# EAGLE schematic Mainboard_v3_modular (EAGLE 7.7.0)
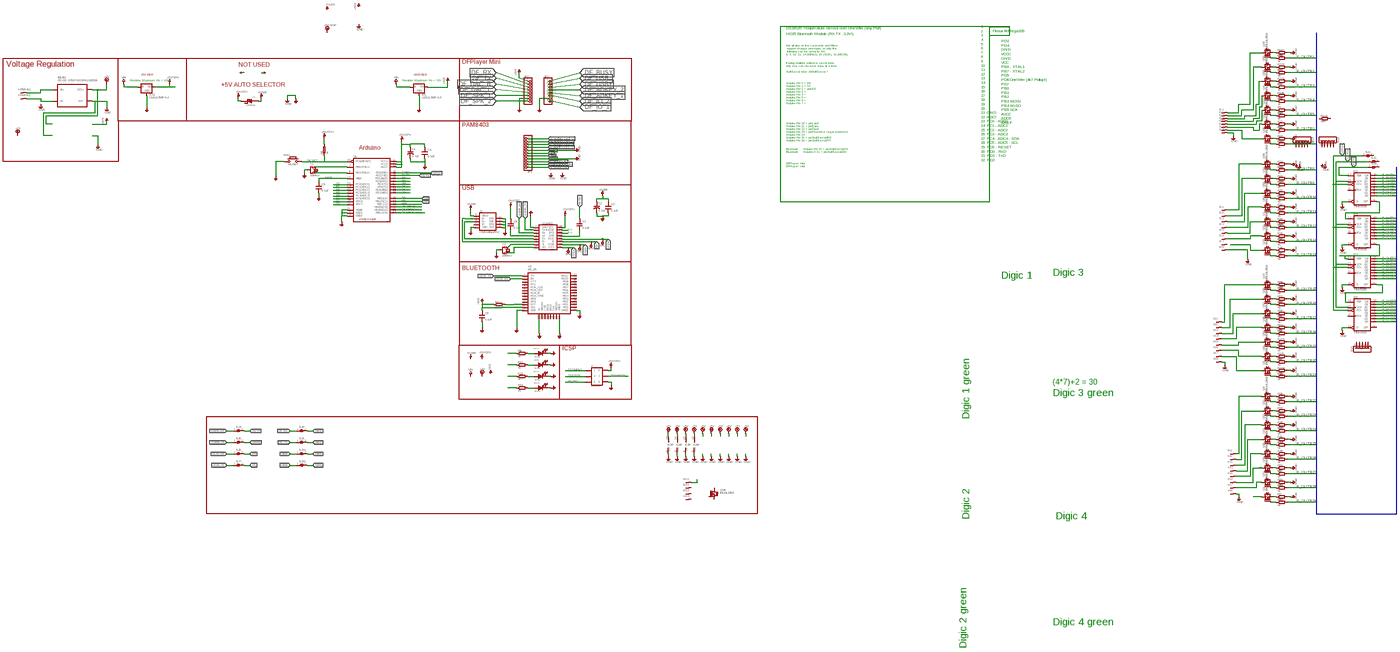
[diagram p0: schematic, sheet 1, overview]
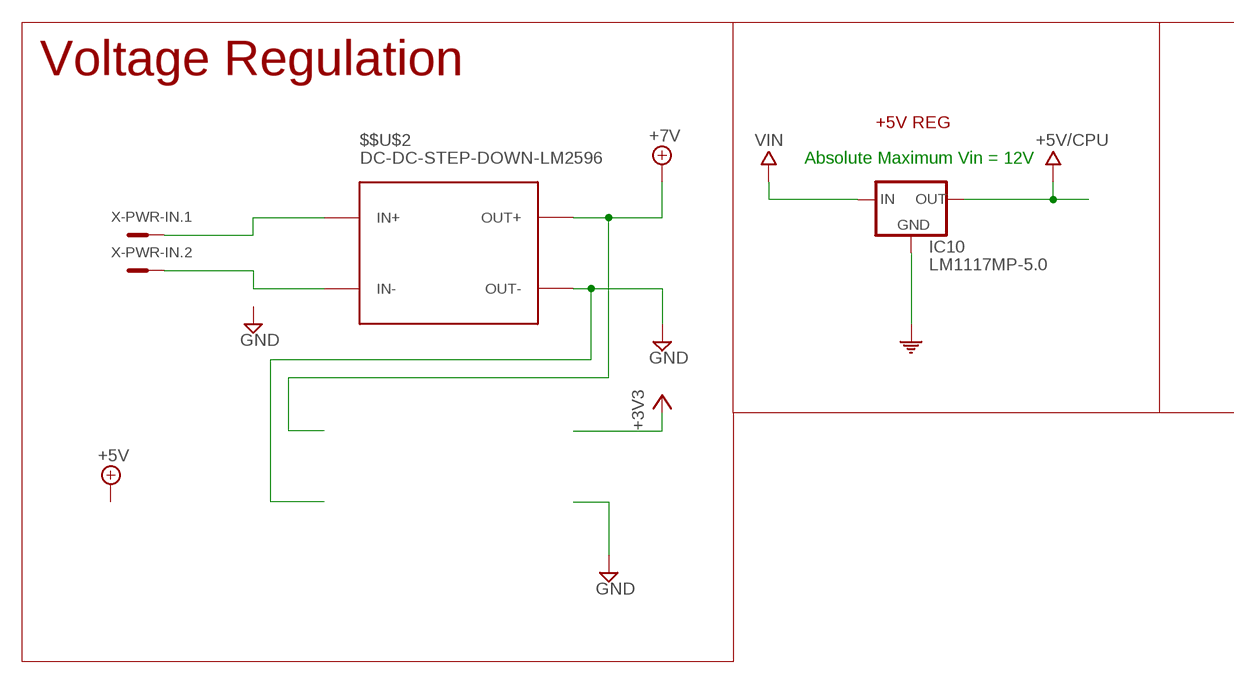
[diagram p1: schematic, sheet 1, part 1 of 5]
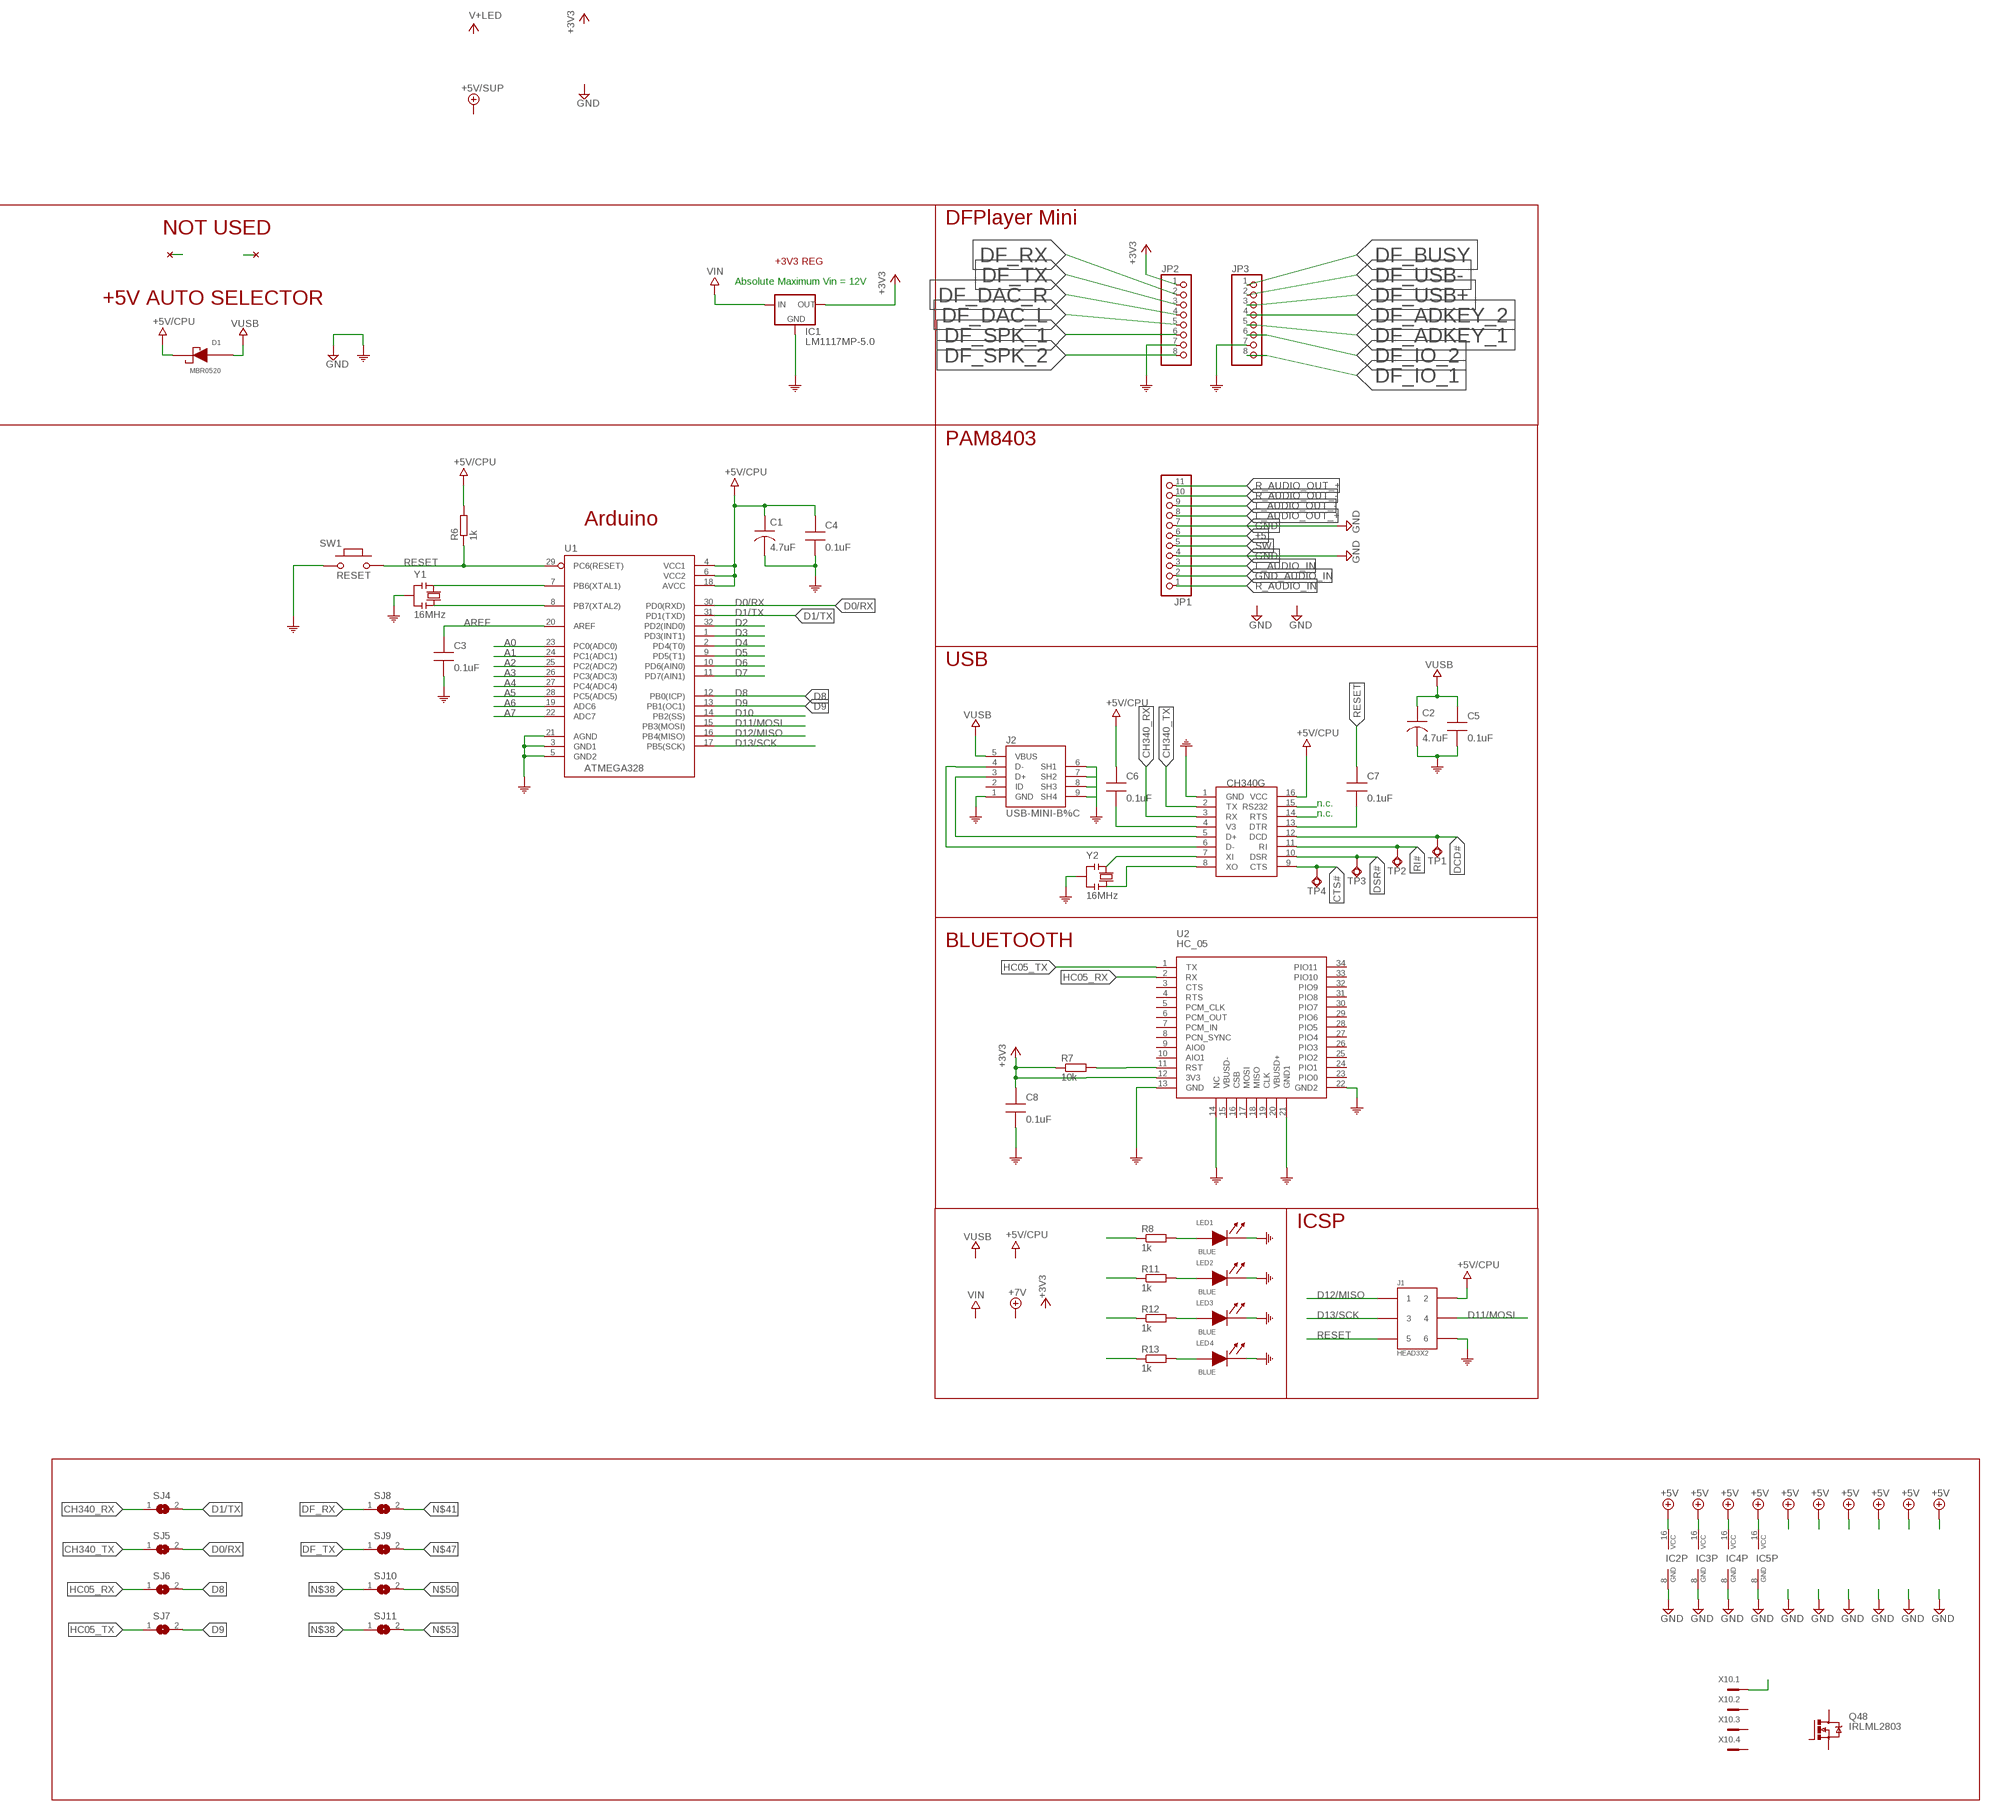
[diagram p2: schematic, sheet 1, part 2 of 5]
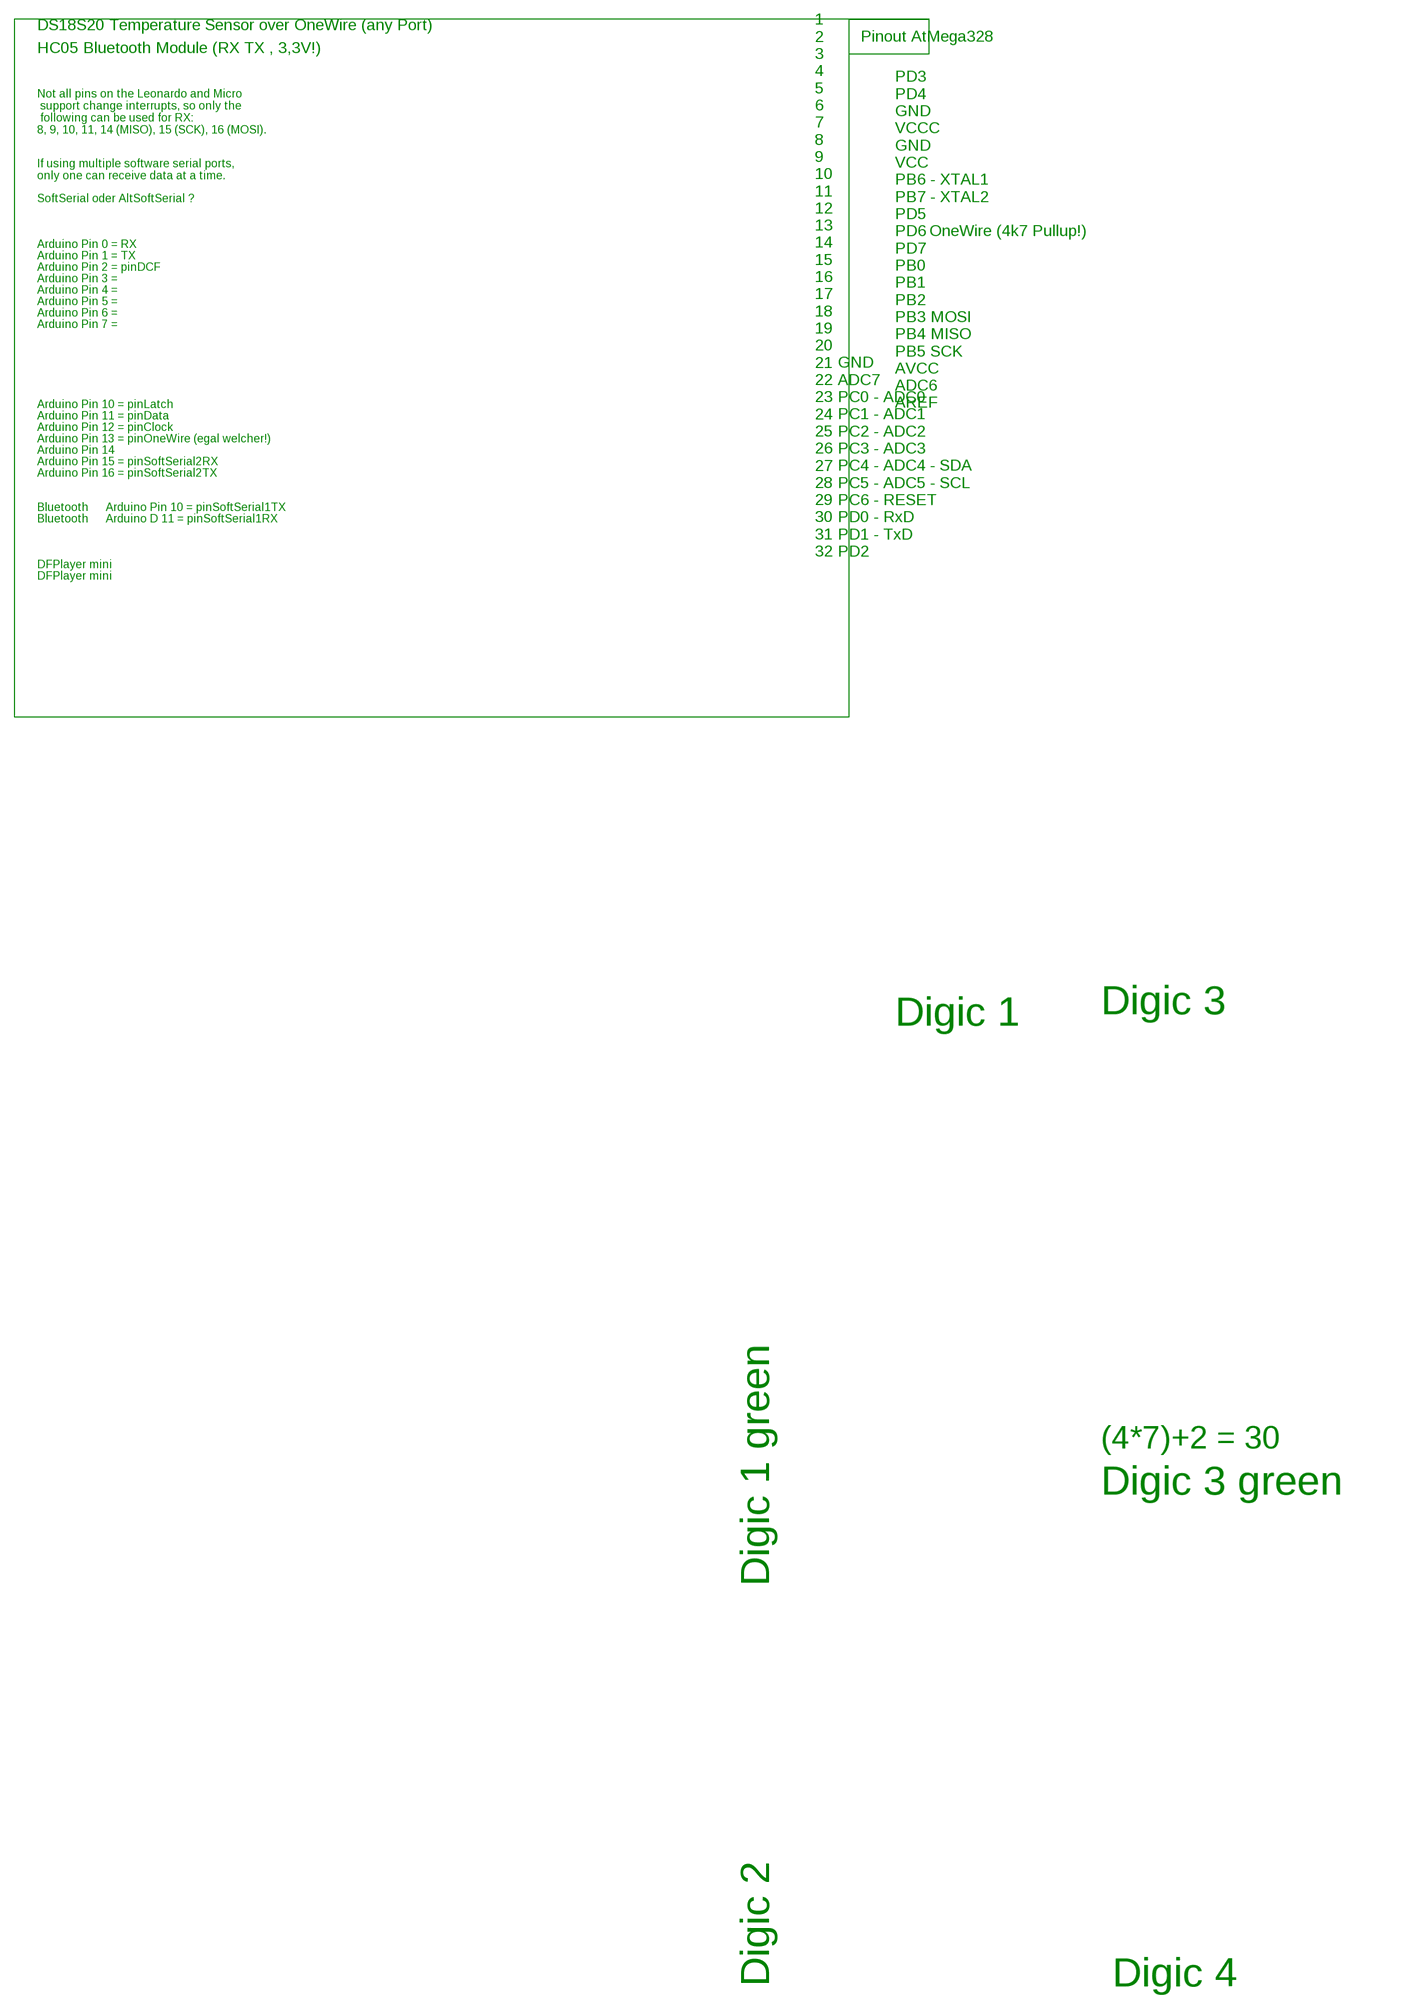
[diagram p3: schematic, sheet 1, part 3 of 5]
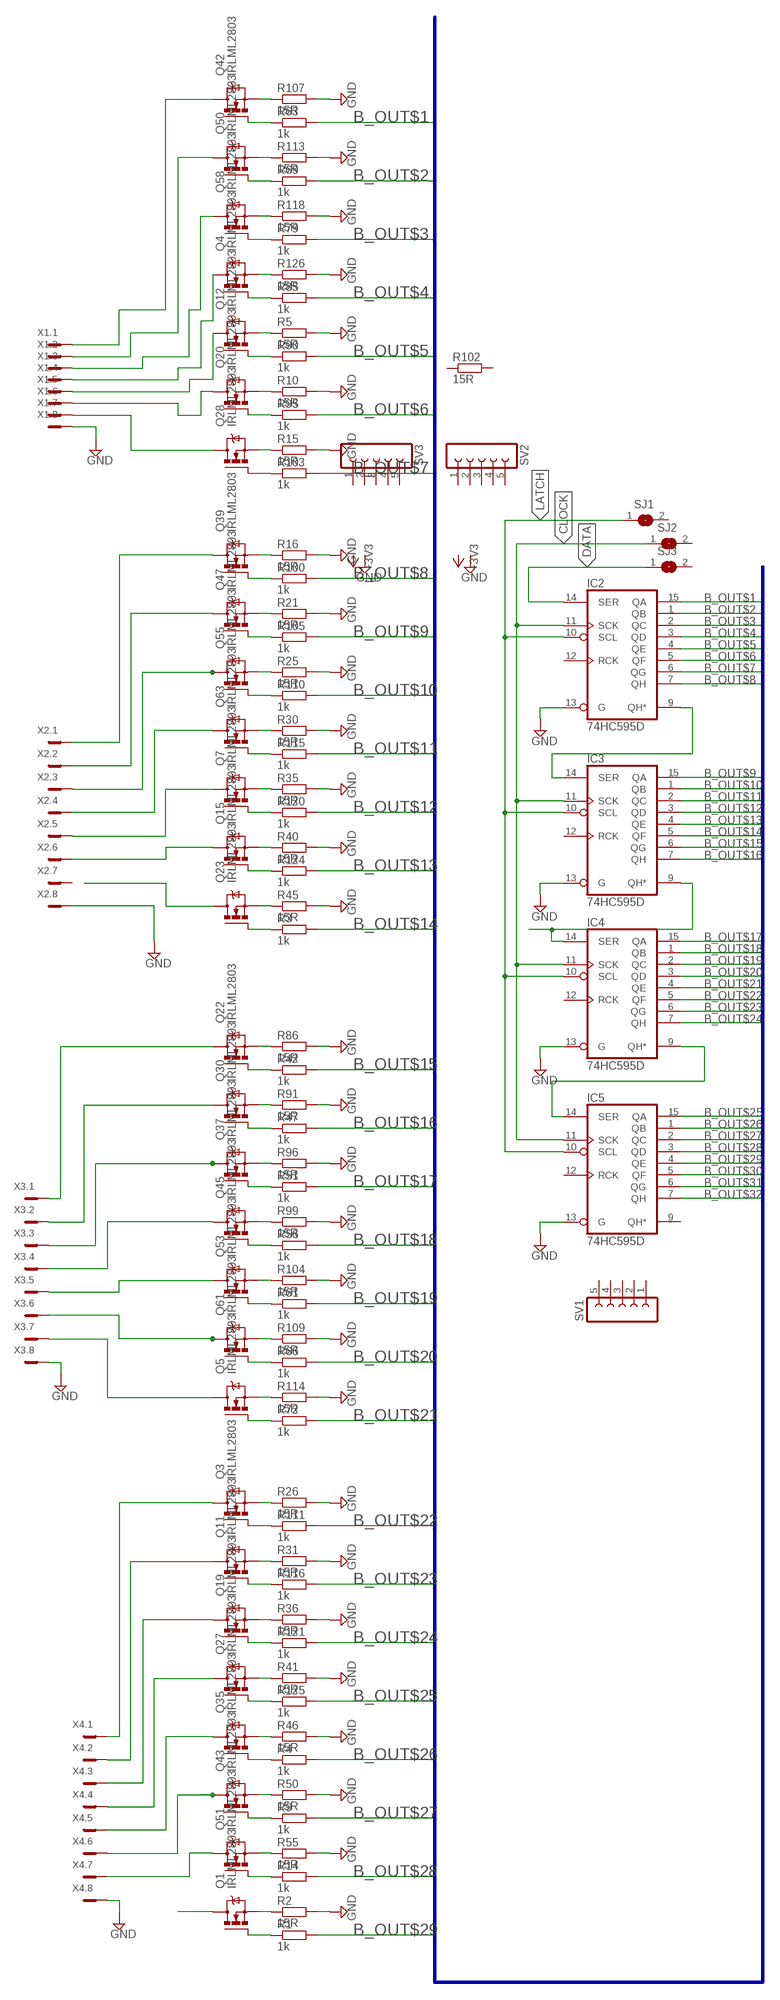
[diagram p4: schematic, sheet 1, part 4 of 5]
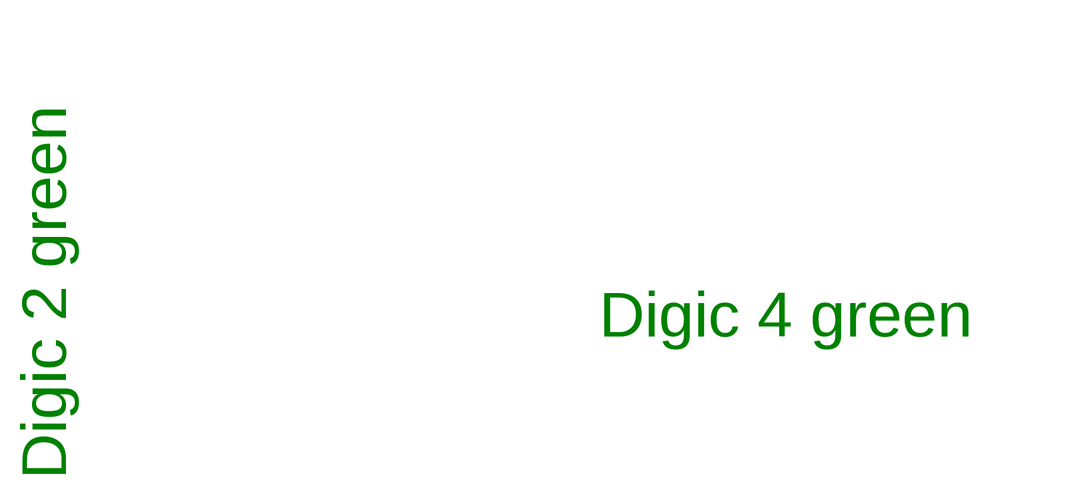
[diagram p5: schematic, sheet 1, part 5 of 5]

## Parts
$$U$2  DC-DC-STEP-DOWN-LM2596  [DC-DC-STEP-DOWN-LM2596]
C1  4.7uF  CAP-TANA-P  [TAN-A]
C2  4.7uF  CAP-TANA-P  [TAN-A]
C3  0.1uF  CAP0805-NP  [CAP0805-NP]
C4  0.1uF  CAP0805-NP  [CAP0805-NP]
C5  0.1uF  CAP0805-NP  [CAP0805-NP]
C6  0.1uF  CAP0805-NP  [CAP0805-NP]
C7  0.1uF  CAP0805-NP  [CAP0805-NP]
C8  0.1uF  CAP0805-NP  [CAP0805-NP]
D1  MBR0520  [SOD-123]
IC1  LM1117MP-5.0  [SOT223]
IC2  74HC595D  [SO16]
IC3  74HC595D  [SO16]
IC4  74HC595D  [SO16]
IC5  74HC595D  [SO16]
IC10  LM1117MP-5.0  [SOT223]
J1  HEAD3X2  [HEAD3X2]
J2  USB-MINI-B%C  [USB-MINI-B_2]
JP1  PINHD-1X11_2.00  [1X11M]
JP2  PINHD-1X8  [1X08]
JP3  PINHD-1X8  [1X08]
LED1  BLUE  LED0805  [LED0805]
LED2  BLUE  LED0805  [LED0805]
LED3  BLUE  LED0805  [LED0805]
LED4  BLUE  LED0805  [LED0805]
Q1  IRLML2803  [MICRO3]
Q3  IRLML2803  [MICRO3]
Q4  IRLML2803  [MICRO3]
Q5  IRLML2803  [MICRO3]
Q7  IRLML2803  [MICRO3]
Q11  IRLML2803  [MICRO3]
Q12  IRLML2803  [MICRO3]
Q15  IRLML2803  [MICRO3]
Q19  IRLML2803  [MICRO3]
Q20  IRLML2803  [MICRO3]
Q22  IRLML2803  [MICRO3]
Q23  IRLML2803  [MICRO3]
Q27  IRLML2803  [MICRO3]
Q28  IRLML2803  [MICRO3]
Q30  IRLML2803  [MICRO3]
Q35  IRLML2803  [MICRO3]
Q37  IRLML2803  [MICRO3]
Q39  IRLML2803  [MICRO3]
Q42  IRLML2803  [MICRO3]
Q43  IRLML2803  [MICRO3]
Q45  IRLML2803  [MICRO3]
Q47  IRLML2803  [MICRO3]
Q48  IRLML2803  [MICRO3]
Q50  IRLML2803  [MICRO3]
Q51  IRLML2803  [MICRO3]
Q53  IRLML2803  [MICRO3]
Q55  IRLML2803  [MICRO3]
Q58  IRLML2803  [MICRO3]
Q61  IRLML2803  [MICRO3]
Q63  IRLML2803  [MICRO3]
R1  1k  R-EU_M0805  [M0805]
R2  15R  R-EU_M1206  [M1206]
R3  1k  R-EU_M0805  [M0805]
R4  1k  R-EU_M0805  [M0805]
R5  15R  R-EU_M1206  [M1206]
R6  1k  R-EU_M1206  [M1206]
R7  10k  R-EU_M1206  [M1206]
R8  1k  R-EU_M1206  [M1206]
R9  1k  R-EU_M0805  [M0805]
R10  15R  R-EU_M1206  [M1206]
R11  1k  R-EU_M1206  [M1206]
R12  1k  R-EU_M1206  [M1206]
R13  1k  R-EU_M1206  [M1206]
R14  1k  R-EU_M0805  [M0805]
R15  15R  R-EU_M1206  [M1206]
R16  15R  R-EU_M1206  [M1206]
R21  15R  R-EU_M1206  [M1206]
R25  15R  R-EU_M1206  [M1206]
R26  15R  R-EU_M1206  [M1206]
R30  15R  R-EU_M1206  [M1206]
R31  15R  R-EU_M1206  [M1206]
R35  15R  R-EU_M1206  [M1206]
R36  15R  R-EU_M1206  [M1206]
R40  15R  R-EU_M1206  [M1206]
R41  15R  R-EU_M1206  [M1206]
R42  1k  R-EU_M0805  [M0805]
R45  15R  R-EU_M1206  [M1206]
R46  15R  R-EU_M1206  [M1206]
R47  1k  R-EU_M0805  [M0805]
R50  15R  R-EU_M1206  [M1206]
R51  1k  R-EU_M0805  [M0805]
R55  15R  R-EU_M1206  [M1206]
R56  1k  R-EU_M0805  [M0805]
R61  1k  R-EU_M0805  [M0805]
R63  1k  R-EU_M0805  [M0805]
R66  1k  R-EU_M0805  [M0805]
R69  1k  R-EU_M0805  [M0805]
R72  1k  R-EU_M0805  [M0805]
R79  1k  R-EU_M0805  [M0805]
R85  1k  R-EU_M0805  [M0805]
R86  15R  R-EU_M1206  [M1206]
R90  1k  R-EU_M0805  [M0805]
R91  15R  R-EU_M1206  [M1206]
R95  1k  R-EU_M0805  [M0805]
R96  15R  R-EU_M1206  [M1206]
R99  15R  R-EU_M1206  [M1206]
R100  1k  R-EU_M0805  [M0805]
R102  15R  R-EU_M1206  [M1206]
R103  1k  R-EU_M0805  [M0805]
R104  15R  R-EU_M1206  [M1206]
R105  1k  R-EU_M0805  [M0805]
R107  15R  R-EU_M1206  [M1206]
R109  15R  R-EU_M1206  [M1206]
R110  1k  R-EU_M0805  [M0805]
R111  1k  R-EU_M0805  [M0805]
R113  15R  R-EU_M1206  [M1206]
R114  15R  R-EU_M1206  [M1206]
R115  1k  R-EU_M0805  [M0805]
R116  1k  R-EU_M0805  [M0805]
R118  15R  R-EU_M1206  [M1206]
R120  1k  R-EU_M0805  [M0805]
R121  1k  R-EU_M0805  [M0805]
R124  1k  R-EU_M0805  [M0805]
R125  1k  R-EU_M0805  [M0805]
R126  15R  R-EU_M1206  [M1206]
SJ1  SJ  [SJ]
SJ2  SJ  [SJ]
SJ3  SJ  [SJ]
SJ4  SJ  [SJ]
SJ5  SJ  [SJ]
SJ6  SJ  [SJ]
SJ7  SJ  [SJ]
SJ8  SJ  [SJ]
SJ9  SJ  [SJ]
SJ10  SJ  [SJ]
SJ11  SJ  [SJ]
SV1  FE05-1  [FE05-1]
SV2  FE05-1  [FE05-1]
SV3  FE05-1  [FE05-1]
SW1  RESET  PB157  [157SW]
TP1  TPSQTP14R  [TP14R]
TP2  TPSQTP14R  [TP14R]
TP3  TPSQTP14R  [TP14R]
TP4  TPSQTP14R  [TP14R]
U1  ATMEGA328  ATMEGA168-20AU  [QFP032]
U2  HC_05  [BLUETOOTH_SMD]
U$9  CH340G  [SOIC16]
X1  MCV8-LOCK  [MCV8-LOCK]
X2  MCV8-LOCK  [MCV8-LOCK]
X3  MCV8-LOCK  [MCV8-LOCK]
X4  MCV8-LOCK  [MCV8-LOCK]
X10  MCV4-LOCK  [MCV4-LOCK]
X-PWR-IN  MCV2-LOCK  [MCV2-LOCK]
Y1  16MHz  RESONATORMU  [RESONATOR]
Y2  16MHz  RESONATORMU  [RESONATOR]

## Nets
+3V3: C8.1 IC1.2(OUT) IC1.4(OUT) JP2.1 R7.1 U2.12(3V3)
+5: JP1.6
+5V: C1.1 C4.1 C6.1 D1.1(CA) IC2.16(VCC) IC3.16(VCC) IC4.16(VCC) IC5.16(VCC) IC10.2(OUT) IC10.4(OUT) J1.2 R6.2 U1.4(VCC1) U1.6(VCC2) U1.18(AVCC) U$9.16(VCC) ; supply symbol labelled +5V/CPU
+7V: $$U$2.OUT+
A0: U1.23(PC0(ADC0))
A1: U1.24(PC1(ADC1))
A2: U1.25(PC2(ADC2))
A3: U1.26(PC3(ADC3))
A4: U1.27(PC4(ADC4))
A5: U1.28(PC5(ADC5))
A6: U1.19(ADC6)
A7: U1.22(ADC7)
AREF: C3.1 U1.20(AREF)
B_OUT$1: IC2.15(QA) R63.2
B_OUT$2: IC2.1(QB) R69.2
B_OUT$3: IC2.2(QC) R79.2
B_OUT$4: IC2.3(QD) R85.2
B_OUT$5: IC2.4(QE) R90.2
B_OUT$6: IC2.5(QF) R95.2
B_OUT$7: IC2.6(QG) R103.2
B_OUT$8: IC2.7(QH) R100.2
B_OUT$9: IC3.15(QA) R105.2
B_OUT$10: IC3.1(QB) R110.2
B_OUT$11: IC3.2(QC) R115.2
B_OUT$12: IC3.3(QD) R120.2
B_OUT$13: IC3.4(QE) R124.2
B_OUT$14: IC3.5(QF) R3.2
B_OUT$15: IC3.6(QG) R42.2
B_OUT$16: IC3.7(QH) R47.2
B_OUT$17: IC4.15(QA) R51.2
B_OUT$18: IC4.1(QB) R56.2
B_OUT$19: IC4.2(QC) R61.2
B_OUT$20: IC4.3(QD) R66.2
B_OUT$21: IC4.4(QE) R72.2
B_OUT$22: IC4.5(QF) R111.2
B_OUT$23: IC4.6(QG) R116.2
B_OUT$24: IC4.7(QH) R121.2
B_OUT$25: IC5.15(QA) R125.2
B_OUT$26: IC5.1(QB) R4.2
B_OUT$27: IC5.2(QC) R9.2
B_OUT$28: IC5.3(QD) R14.2
B_OUT$29: IC5.4(QE) R1.2
B_OUT$30: IC5.5(QF)
B_OUT$31: IC5.6(QG)
B_OUT$32: IC5.7(QH)
CH340_RX: SJ4.1 U$9.3(RX)
CH340_TX: SJ5.1 U$9.2(TX)
CLOCK: IC2.11(SCK) IC3.11(SCK) IC4.11(SCK) IC5.11(SCK) SJ2.1
COM: C1.2 C2.2 C3.2 C4.2 C5.2 C8.2 IC1.1(GND) IC10.1(GND) J1.6 J2.1(GND) J2.6(SH1) J2.7(SH2) J2.8(SH3) J2.9(SH4) JP2.7 JP3.7 LED1.1(CA) LED2.1(CA) LED3.1(CA) LED4.1(CA) SW1.1 U1.3(GND1) U1.5(GND2) U1.21(AGND) U2.13(GND) U2.14(NC) U2.21(GND1) U2.22(GND2) U$9.1(GND) Y1.2 Y2.2
CTS#: TP4.TP U$9.9(CTS)
D0/RX: SJ5.2 U1.30(PD0(RXD))
D1/TX: SJ4.2 U1.31(PD1(TXD))
D2: U1.32(PD2(IND0))
D3: U1.1(PD3(INT1))
D4: U1.2(PD4(T0))
D5: U1.9(PD5(T1))
D6: U1.10(PD6(AIN0))
D7: U1.11(PD7(AIN1))
D8: SJ6.2 U1.12(PB0(ICP))
D9: SJ7.2 U1.13(PB1(OC1))
D10: U1.14(PB2(SS))
D11/MOSI: J1.4 U1.15(PB3(MOSI))
D12/MISO: J1.1 U1.16(PB4(MISO))
D13/SCK: J1.3 U1.17(PB5(SCK))
DATA: IC2.14(SER) SJ3.1
DCD#: TP1.TP U$9.12(DCD)
DF_ADKEY_1: JP3.5
DF_ADKEY_2: JP3.4
DF_BUSY: JP3.1
DF_DAC_L: JP2.5
DF_DAC_R: JP2.4
DF_IO_1: JP3.8
DF_IO_2: JP3.6
DF_RX: JP2.2 SJ8.1
DF_SPK_1: JP2.6
DF_SPK_2: JP2.8
DF_TX: JP2.3 SJ9.1
DF_USB+: JP3.3
DF_USB-: JP3.2
DSR#: TP3.TP U$9.10(DSR)
GND: $$U$2.OUT- IC2.8(GND) IC2.13(G) IC3.8(GND) IC3.13(G) IC4.8(GND) IC4.13(G) IC5.8(GND) IC5.13(G) JP1.4 JP1.7 R2.2 R5.2 R10.2 R15.2 R16.2 R21.2 R25.2 R26.2 R30.2 R31.2 R35.2 R36.2 R40.2 R41.2 R45.2 R46.2 R50.2 R55.2 R86.2 R91.2 R96.2 R99.2 R104.2 R107.2 R109.2 R113.2 R114.2 R118.2 R126.2 X1.8 X2.8 X3.8 X4.8 ; supply symbol labelled COM
GND_AUDIO_IN: JP1.2
HC05_RX: SJ6.1 U2.2(RX)
HC05_TX: SJ7.1 U2.1(TX)
L_AUDIO_IN: JP1.3
L_AUDIO_OUT_+: JP1.8
L_AUDIO_OUT_-: JP1.9
LATCH: IC2.10(SCL) IC3.10(SCL) IC4.10(SCL) IC5.10(SCL) SJ1.1
N$1: U1.8(PB7(XTAL2)) Y1.3
N$2: U1.7(PB6(XTAL1)) Y1.1
N$3: LED1.2(AN) R8.2
N$4: $$U$2.IN+ X-PWR-IN.1
N$5: J2.3(D+) U$9.5(D+)
N$6: J2.4(D-) U$9.6(D-)
N$7: $$U$2.IN- X-PWR-IN.2
N$8: X10.1
N$9: Q3.3(D) X4.1
N$10: Q1.2(S) R2.1
N$11: IC2.9(QH*) IC3.14(SER)
N$12: Q1.1(G) R1.1
N$13: Q1.3(D)
N$14: IC3.9(QH*) IC4.14(SER)
N$15: Q39.3(D) X2.1
N$16: Q55.3(D) X2.3
N$17: Q19.3(D) X4.3
N$18: Q63.3(D) X2.4
N$19: Q7.3(D) X2.5
N$20: IC4.9(QH*) IC5.14(SER)
N$21: Q23.3(D)
N$22: Q11.3(D) X4.2
N$23: Q27.3(D) X4.4
N$26: Q35.3(D) X4.5
N$28: Q5.3(D) X3.7
N$29: Q51.3(D) X4.7
N$30: U$9.7(XI) Y2.1
N$31: U$9.8(XO) Y2.3
N$32: LED2.2(AN) R11.2
N$33: LED3.2(AN) R12.2
N$34: C6.2 U$9.4(V3)
N$35: U$9.15(RS232)
N$36: U$9.14(RTS)
N$37: C7.2 U$9.13(DTR)
N$38: SJ10.1 SJ11.1
N$39: Q39.2(S) R16.1
N$40: Q39.1(G) R100.1
N$41: SJ8.2
N$42: Q47.2(S) R21.1
N$43: Q47.1(G) R105.1
N$44: R7.2 U2.11(RST)
N$45: Q55.2(S) R25.1
N$46: Q55.1(G) R110.1
N$47: SJ9.2
N$48: Q63.2(S) R30.1
N$49: Q63.1(G) R115.1
N$50: SJ10.2
N$51: Q7.2(S) R35.1
N$52: Q7.1(G) R120.1
N$53: SJ11.2
N$54: Q15.2(S) R40.1
N$55: Q15.1(G) R124.1
N$56: LED4.2(AN) R13.2
N$57: Q23.2(S) R45.1
N$58: Q23.1(G) R3.1
N$59: R13.1
N$60: R12.1
N$61: Q15.3(D) X2.6
N$62: R11.1
N$63: R8.1
N$65: Q47.3(D) X2.2
N$95: Q22.2(S) R86.1
N$96: Q22.1(G) R42.1
N$98: Q30.2(S) R91.1
N$99: Q30.1(G) R47.1
N$101: Q37.2(S) R96.1
N$102: Q37.1(G) R51.1
N$104: Q45.2(S) R99.1
N$105: Q45.1(G) R56.1
N$107: Q53.2(S) R104.1
N$108: Q53.1(G) R61.1
N$110: Q61.2(S) R109.1
N$111: Q61.1(G) R66.1
N$113: Q5.2(S) R114.1
N$114: Q5.1(G) R72.1
N$117: Q61.3(D) X3.6
N$118: Q53.3(D) X3.5
N$119: Q45.3(D) X3.4
N$120: Q37.3(D) X3.3
N$121: Q30.3(D) X3.2
N$122: Q22.3(D) X3.1
N$151: Q3.2(S) R26.1
N$152: Q3.1(G) R111.1
N$154: Q11.2(S) R31.1
N$155: Q11.1(G) R116.1
N$157: Q19.2(S) R36.1
N$158: Q19.1(G) R121.1
N$160: Q27.2(S) R41.1
N$161: Q27.1(G) R125.1
N$163: Q35.2(S) R46.1
N$164: Q35.1(G) R4.1
N$166: Q43.2(S) R50.1
N$167: Q43.1(G) R9.1
N$169: Q51.2(S) R55.1
N$170: Q51.1(G) R14.1
N$173: Q43.3(D) X4.6
N$203: Q58.2(S) R118.1
N$204: Q42.2(S) R107.1
N$205: Q42.1(G) R63.1
N$207: Q58.1(G) R79.1
N$208: Q50.2(S) R113.1
N$209: Q50.1(G) R69.1
N$212: Q4.2(S) R126.1
N$213: Q4.1(G) R85.1
N$215: Q12.2(S) R5.1
N$216: Q12.1(G) R90.1
N$218: Q20.2(S) R10.1
N$219: Q20.1(G) R95.1
N$221: Q28.2(S) R15.1
N$222: Q28.1(G) R103.1
N$224: Q28.3(D) X1.7
N$225: Q20.3(D) X1.6
N$226: Q12.3(D) X1.5
N$227: Q4.3(D) X1.4
N$228: Q58.3(D) X1.3
N$229: Q50.3(D) X1.2
N$230: Q42.3(D) X1.1
R_AUDIO_IN: JP1.1
R_AUDIO_OUT_+: JP1.11
R_AUDIO_OUT_-: JP1.10
RESET: C7.1 J1.5 R6.1 SW1.2 U1.29(PC6(RESET))
RI#: TP2.TP U$9.11(RI)
SW: JP1.5
VIN: IC1.3(IN) IC10.3(IN)
VUSB: C2.1 C5.1 D1.2(AN) J2.5(VBUS)
Unconnected: IC2.12(RCK) IC3.12(RCK) IC4.12(RCK) IC5.9(QH*) IC5.12(RCK) J2.2(ID) Q48.1(G) Q48.2(S) Q48.3(D) R102.1 R102.2 SJ1.2 SJ2.2 SJ3.2 SV1.1 SV1.2 SV1.3 SV1.4 SV1.5 SV2.1 SV2.2 SV2.3 SV2.4 SV2.5 SV3.1 SV3.2 SV3.3 SV3.4 SV3.5 U2.3(CTS) U2.4(RTS) U2.5(PCM_CLK) U2.6(PCM_OUT) U2.7(PCM_IN) U2.8(PCN_SYNC) U2.9(AIO0) U2.10(AIO1) U2.15(VBUSD-) U2.16(CSB) U2.17(MOSI) U2.18(MISO) U2.19(CLK) U2.20(VBUSD+) U2.23(PIO0) U2.24(PIO1) U2.25(PIO2) U2.26(PIO3) U2.27(PIO4) U2.28(PIO5) U2.29(PIO6) U2.30(PIO7) U2.31(PIO8) U2.32(PIO9) U2.33(PIO10) U2.34(PIO11) X2.7 X10.2 X10.3 X10.4

## Buses
B_OUT$[1..72]

## Notes on the sheet
- DS18S20 Temperature Sensor over OneWire (any Port)
- Pinout AtMega328
- HC05 Bluetooth Module (RX TX , 3,3V!)
- Not all pins on the Leonardo and Micro
   support change interrupts, so only the
   following can be used for RX: 
  8, 9, 10, 11, 14 (MISO), 15 (SCK), 16 (MOSI).
- DFPlayer Mini
- PD3
  PD4
  GND
  VCCC
  GND
  VCC
- Voltage Regulation | NOT USED
- If using multiple software serial ports, 
  only one can receive data at a time.
- SoftSerial oder AltSoftSerial ?
- +5V REG | +3V3 REG
- Absolute Maximum Vin = 12V | Absolute Maximum Vin = 12V | OneWire (4k7 Pullup!)
- Arduino Pin 0 = RX
- +5V AUTO SELECTOR | Arduino Pin 1 = TX
- Arduino Pin 2 = pinDCF
- Arduino Pin 3 =
- Arduino Pin 4 =
- Arduino Pin 5 =
- Arduino Pin 6 =
- Arduino Pin 7 =
- Arduino Pin 10 = pinLatch
- PB6 - XTAL1
  PB7 - XTAL2
  PD5 
  PD6
  PD7
  PB0
  PB1
  PB2
  PB3 MOSI
  PB4 MISO
  PB5 SCK
  AVCC
  ADC6
  AREF
- PAM8403 | Arduino Pin 11 = pinData
- Arduino Pin 12 = pinClock
- Arduino Pin 13 = pinOneWire (egal welcher!)
- Arduino Pin 14
- Arduino Pin 15 = pinSoftSerial2RX
- Arduino Pin 16 = pinSoftSerial2TX
- Arduino | Bluetooth | Arduino Pin 10 = pinSoftSerial1TX
- Bluetooth | Arduino D 11 = pinSoftSerial1RX
- 1
  2
  3
  4
  5
  6
  7
  8
  9
  10
  11
  12
  13
  14
  15
  16
  17
  18
  19
  20
  21
  22
  23
  24
  25
  26
  27
  28
  29
  30
  31
  32
- GND
  ADC7
  PC0 - ADC0
  PC1 - ADC1
  PC2 - ADC2
  PC3 - ADC3
  PC4 - ADC4 - SDA
  PC5 - ADC5 - SCL
  PC6 - RESET
  PD0 - RxD
  PD1 - TxD
  PD2
- DFPlayer mini
- DFPlayer mini
- USB
- n.c.
- n.c.
- BLUETOOTH
- Digic 1 | Digic 3
- ICSP
- (4*7)+2 = 30
- Digic 3 green
- Digic 1 green
- Digic 2 | Digic 4
- Digic 4 green
- Digic 2 green

## Library data of the parts
$$U$2 = diy_modules:DC-DC-STEP-DOWN-LM2596: DC/DC Step-Down Regulator based on LM2596-ADJ chip
C1 C2 = MySMD:CAP-TANA-P
C3-C8 = MySMD:CAP0805-NP
D1 = MySMD:MBR0520
IC1 IC10 = lm1117_10:LM1117?-*: 800mA Low-Dropout Linear Regulator Source: http://www.ti.com/lit/ds/symlink/lm1117-n.pdf; MF: Texas Instruments; MPN: LM1117MP-5.0; OC_FARNELL: 9778209; OC_NEWARK: 28X3417
IC2-IC5 = 74xx-eu:74*595: 8-bit SHIFT REGISTER, output latch
J1 = MyCON2:HEAD3X2
J2 = MyCON2:USB-MINI-B
JP1 = pinhead-1:PINHD-1X11: PIN HEADER
JP2 JP3 = pinhead:PINHD-1X8: PIN HEADER
LED1-LED4 = MySMD:LED0805
Q1 Q3-Q5 Q7 Q11 Q12 Q15 Q19 Q20 Q22 Q23 Q27 Q28 Q30 Q35 Q37 Q39 Q42 Q43 Q45 Q47 Q48 Q50 Q51 Q53 Q55 Q58 Q61 Q63 = irlml2803:IRLML2803: IRLML 2803 NFET HEXFET POWERMOSFET N-LogicLevel VDSS = 30V RDS(ON) = 0,25R SOT 23 1,2A max @ 25° Height = 1,1mm
R1-R16 R21 R25 R26 R30 R31 R35 R36 R40-R42 R45-R47 R50 R51 R55 R56 R61 R63 R66 R69 R72 R79 R85 R86 R90 R91 R95 R96 R99 R100 R102-R105 R107 R109-R111 R113-R116 R118 R120 R121 R124-R126 = rcl:R-EU_: RESISTOR, European symbol
SJ1-SJ11 = jumper:SJ: SMD solder JUMPER
SV1-SV3 = con-lsta:FE05-1: FEMALE HEADER; OC_FARNELL: unknown; OC_NEWARK: unknown
SW1 = MySMD:PB157
TP1-TP4 = testpad:TPSQ: Test pad
U1 = MySMD:ATMEGA168-20AU
U2 = SerialPortBluetooth:HC_05
U$9 = ch340g:CH340G
X1-X4 = con-phoenix_3.81_mcv:MCV8-LOCK: Phoenix Contact: MCV 1.5/8-GF-3.81
X10 = con-phoenix_3.81_mcv:MCV4-LOCK: Phoenix Contact: MCV 1.5/4-GF-3.81
X-PWR-IN = con-phoenix_3.81_mcv:MCV2-LOCK: Phoenix Contact: MCV 1.5/2-GF-3.81
Y1 Y2 = MySMD2:RESONATOR